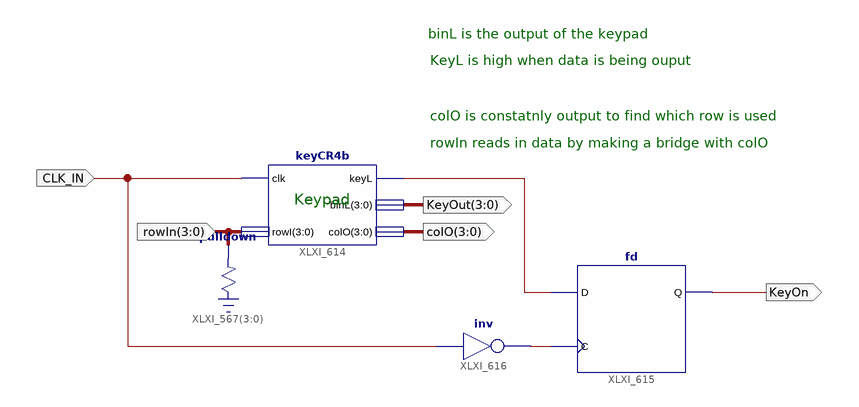
[diagram p0: schematic sheet 1]
// Xilinx ISE schematic keypad.sch (spartan3e) as structural Verilog: 4 symbols, 5 ports
module keypad (
  input  [3:0] rowIn,
  input  CLK_IN,
  output [3:0] KeyOut,
  output [3:0] colO,
  output KeyOn
);

  wire XLXN_3, XLXN_5;

  \pulldown  XLXI_567[3:0] (.O(rowIn));
  keyCR4b XLXI_614 (.clk(CLK_IN), .rowI(rowIn), .colO(colO), .keyL(XLXN_5), .binL(KeyOut));
  fd XLXI_615 (.C(XLXN_3), .D(XLXN_5), .Q(KeyOn));
  not XLXI_616 (XLXN_3, CLK_IN);

  // Notes on the sheet:
  //   binL is the output of the keypad
  //   KeyL is high when data is being ouput
  //   colO is constatnly output to find which row is used
  //   rowIn reads in data by making a bridge with colO
  //   Keypad
endmodule
